# Altium schematic sheet Heater PCB Column Coil.SchDoc
size A3; SheetNumber: 1; SheetTotal: 1
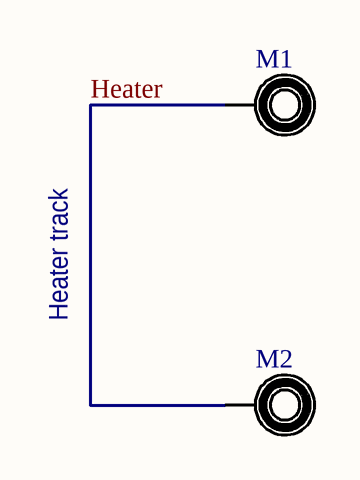
[diagram p0: Heater PCB Column Coil.SchDoc]

## Parts
M1  PTH  [PTH-M3.4-D6.0]  (value not drawn)
M2  PTH  [PTH-M3.4-D6.0]  (value not drawn)

## Nets
Heater: M1.1 M2.1

## Notes on the sheet
- Heater track
- Filename
- Title
- Project
- Date
- Sheet
- Author
- of

## Library data of the parts
M1 M2 = 45001811: Plated Through-Hole, M3.4, Round Pad 6mm; Manufacturer: mechanical; Preferred: 0; id: 45001811; Manufacturer P/N: mechanical; Component Type: Mechanical, Board Item